# Altium project Arduino Uno.PrjPcb
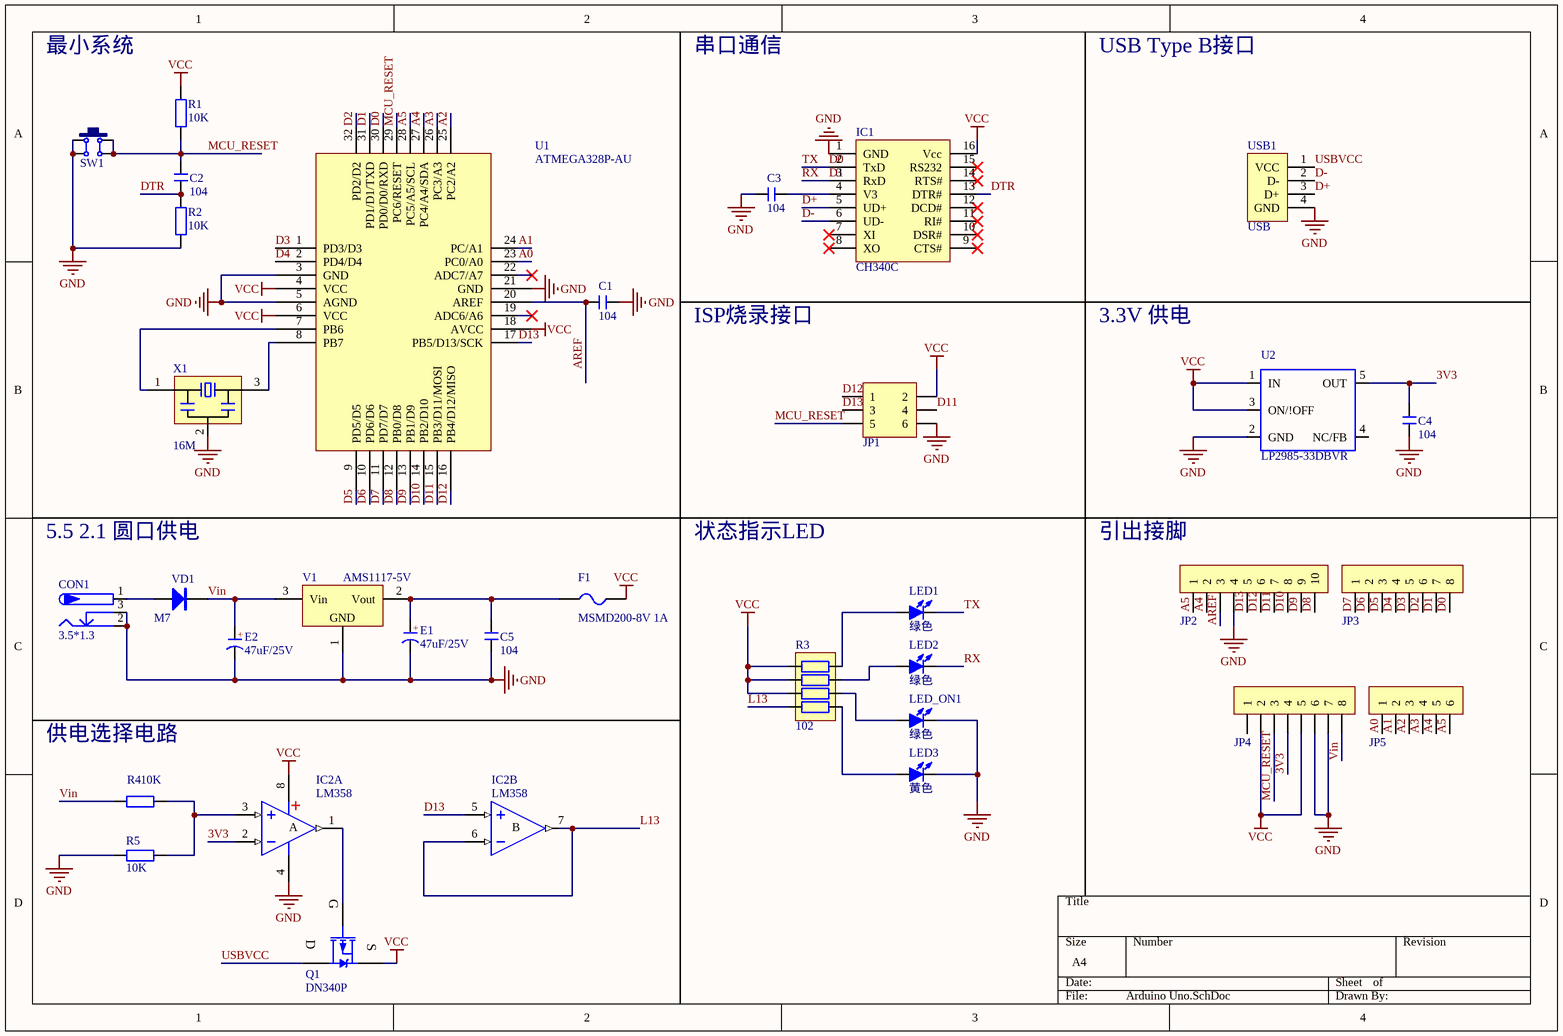
[diagram p0: Arduino Uno.SchDoc]
1 sheet, 33 parts. Net scope: global (net labels, ports and power ports of the same name join across sheets).
Board file: Arduino Uno.PcbDoc

## Sheet Arduino Uno.SchDoc
size A4

### Parts
C1  104  [C 0603_L]
C2  104  [C 0603_L]
C3  104  [C 0603_L]
C4  104  [C 0603_L]
C5  104  [C 0603_L]
CON1  3.5*1.3  [DC-005]
E1  47uF/25V  [CM D(6.3*5.4)]
E2  47uF/25V  [CM D(6.3*5.4)]
F1  MSMD200-8V 1A  [FU 1812]
IC1  CH340C  [SOP16_L]
IC2  LM358  [MSOP8_L]  (parts A,B of 2)
JP1  Header3X2  [HDR2.54-LI-2x3P]  (value not drawn)
JP2  HDR-1X10  [HDR2.54-M-LI-10P]  (value not drawn)
JP3  HDR-1X8  [HDR2.54-M-LI-8P]  (value not drawn)
JP4  HDR-1X8  [HDR2.54-M-LI-8P]  (value not drawn)
JP5  HDR-1X6  [HDR2.54-M-LI-6P]  (value not drawn)
LED1  绿色  [LED 0603B]
LED2  绿色  [LED 0603B]
LED3  黄色  [LED 0603B]
LED_ON1  绿色  [LED 0603B]
Q1  DN340P  [SOT23-3N]
R1  10K  [R 0603_L]
R2  10K  [R 0603_L]
R3  102  [RCA-8P4R-0603]
R4  10K  [R 0603_L]
R5  10K  [R 0603_L]
SW1  4x4x1.5  [TSW SMD-6*6*4.3]  (value not drawn)
U1  ATMEGA328P-AU  [LQFP32 7X7_L]
U2  LP2985-33DBVR  [SOT23-5L]
USB1  USB  [USB-B/S_A]
V1  AMS1117-5V  [SOT223_N]
VD1  M7  [SMA]
X1  16M  [OSC-3.2-1.3-3P]

### Nets
GND: C1.2 C3.1 C4.1 C5.1 CON1.2 CON1.3 E1.2(K) E2.2(K) IC1.1(GND) IC2.4(V-) JP1.6 JP2.4 JP4.6 JP4.7 LED3.2(K) LED_ON1.2(K) R2.1 R5.2 SW1.1 SW1.4 U1.3(GND) U1.5(AGND) U1.21(GND) U2.2(GND) USB1.4(GND) V1.1(GND) X1.2
VCC: F1.2 IC1.16(Vcc) IC2.8(V+) JP1.2 JP4.2 JP4.5 Q1.2(S) R1.1 R3.1 R3.2 R3.3 U1.4(VCC) U1.6(VCC) U1.18(AVCC) U2.1(IN) U2.3(ON/!OFF)
3V3: C4.2 IC2.2(IN-) JP4.4 U2.5(OUT)
A0: JP5.1 U1.23(PC0/A0)
A1: JP5.2 U1.24(PC/A1)
A2: JP5.3 U1.25(PC2/A2)
A3: JP5.4 U1.26(PC3/A3)
A4: JP2.2 JP5.5 U1.27(PC4/A4/SDA)
A5: JP2.1 JP5.6 U1.28(PC5/A5/SCL)
AREF: C1.1 JP2.3 U1.20(AREF)
D0: IC1.2(TxD) JP3.8 LED1.2(K) U1.30(PD0/D0/RXD)  [also labelled TX]
D1: IC1.3(RxD) JP3.7 LED2.2(K) U1.31(PD1/D1/TXD)  [also labelled RX]
D2: JP3.6 U1.32(PD2/D2)
D3: JP3.5 U1.1(PD3/D3)
D4: JP3.4 U1.2(PD4/D4)
D5: JP3.3 U1.9(PD5/D5)
D6: JP3.2 U1.10(PD6/D6)
D7: JP3.1 U1.11(PD7/D7)
D8: JP2.10 U1.12(PB0/D8)
D9: JP2.9 U1.13(PB1/D9)
D10: JP2.8 U1.14(PB2/D10)
D11: JP1.4 JP2.7 U1.15(PB3/D11/MOSI)
D12: JP1.1 JP2.6 U1.16(PB4/D12/MISO)
D13: IC2.5(IN+) JP1.3 JP2.5 U1.17(PB5/D13/SCK)
D+: IC1.5(UD+) USB1.3(D+)
D-: IC1.6(UD-) USB1.2(D-)
DTR: C2.1 IC1.13(DTR#) R2.2
L13: IC2.6(IN-) IC2.7(OUT) R3.4
MCU_RESET: C2.2 JP1.5 JP4.3 R1.2 SW1.2 SW1.3 U1.29(PC6/RESET)
USBVCC: Q1.3(D) USB1.1(VCC)
Vin: E2.1(A) JP4.8 R4.2 V1.3(Vin) VD1.2(K)
NetC3_2: C3.2 IC1.4(V3)
NetC5_2: C5.2 E1.1(A) F1.1 V1.2(Vout)
NetCON1_1: CON1.1 VD1.1(A)
NetIC2_1: IC2.1(OUT) Q1.1(G)
NetIC2_3: IC2.3(IN+) R4.1 R5.1
NetLED1_1: LED1.1(A) R3.8
NetLED2_1: LED2.1(A) R3.7
NetLED3_1: LED3.1(A) R3.5
NetLED_ON1_1: LED_ON1.1(A) R3.6
NetU1_7: U1.7(PB6) X1.1
NetU1_8: U1.8(PB7) X1.3

Not connected (* = marked no-connect by the designer): IC1 7(XI)* 8(XO)* 9(CTS#)* 10(DSR#)* 11(RI#)* 12(DCD#)* 14(RTS#)* 15(RS232)*; JP4 1; U1 19(ADC6/A6)* 22(ADC7/A7)*; U2 4(NC/FB)

### Notes on the sheet
- 最小系统
- 串口通信
- USB Type B接口
- ISP烧录接口
- 3.3V 供电
- 5.5 2.1 圆口供电
- 状态指示LED
- 引出接脚
- 供电选择电路
- (in symbol C-CM) +
- (in symbol LM358, part A) A
- (in symbol LM358, part B) B

### Library data of the parts
C1-C5 = C: 无极性贴片电容; 版权归属: 源创客; BOM名称: 无极性贴片电容; 学习资源: www.ooocke.com
CON1 = P-DC: 低压电源接口; BOM名称: DC电源接口; 版权归属: 源创客; 学习资源: www.ooocke.com
E1 E2 = C-CM: 贴片电解电容; 版权归属: 源创客; BOM名称: 贴片电解电容; 学习资源: www.ooocke.com
F1 = FU: 贴片保险丝; 版权归属: 源创客; BOM名称: 贴片保险丝; 学习资源: www.ooocke.com
IC1 = CH340G: 串口转USB; 版权归属: 源创客; BOM名称: 串口转USB; 学习资源: www.ooocke.com
IC2 = LM358: 双路运放; 版权归属: 源创客; BOM名称: 双路运放; 学习资源: www.ooocke.com
JP1 = Header 3X2: 3*2P接插件; 版权归属: 源创客; BOM名称: 3*2P接插件; 学习资源: www.ooocke.com
JP2 = Header 10: 10P接插件; 版权归属: 源创客; BOM名称: 10P接插件; 学习资源: www.ooocke.com
JP3 JP4 = Header 8: 8P接插件; 版权归属: 源创客; BOM名称: 8P接插件; 学习资源: www.ooocke.com
JP5 = Header 6: 6P接插件; 版权归属: 源创客; BOM名称: 6P接插件; 学习资源: www.ooocke.com
LED1-LED3 LED_ON1 = LED-SMD: 贴片LED; 版权归属: 源创客; BOM名称: 贴片LED; 学习资源: www.ooocke.com
Q1 = SI2301: P沟道场效应管; 版权归属: 源创客; BOM名称: P沟道场效应管; 学习资源: www.ooocke.com
R1 R2 R4 R5 = R: 贴片电阻; 版权归属: 源创客; BOM名称: 贴片电阻; 学习资源: www.ooocke.com
R3 = R-8P4R: 贴片网络排阻; 版权归属: 源创客; BOM名称: 贴片网络排阻; 学习资源: www.ooocke.com
SW1 = TS-030: 防水轻触开关; 版权归属: 源创客; BOM名称: 防水轻触开关; 学习资源: www.ooocke.com
U1 = ATMEGA328P: AVR单片机; 版权归属: 源创客; BOM名称: AVR单片机; 学习资源: www.ooocke.com
U2 = LP2985-XXDBVR33
USB1 = USB-B/S: USB-B型母接口; 版权归属: 源创客; BOM名称: USB-B型母接口; 学习资源: www.ooocke.com
V1 = AMS1117: 三端稳压芯片; BOM名称: 稳压芯片; 版权归属: 源创客; 学习资源: www.ooocke.com
VD1 = M7: 整流二极管; 版权归属: 源创客; BOM名称: 整流二极管; 学习资源: www.ooocke.com
X1 = XTAL-3: 3脚晶振; BOM名称: 4脚晶振; 版权归属: 源创客; 学习资源: www.ooocke.com